# Altium schematic sheet scan_chain_level_shifters.SchDoc
size B; SheetNumber: 8; SheetTotal: 9
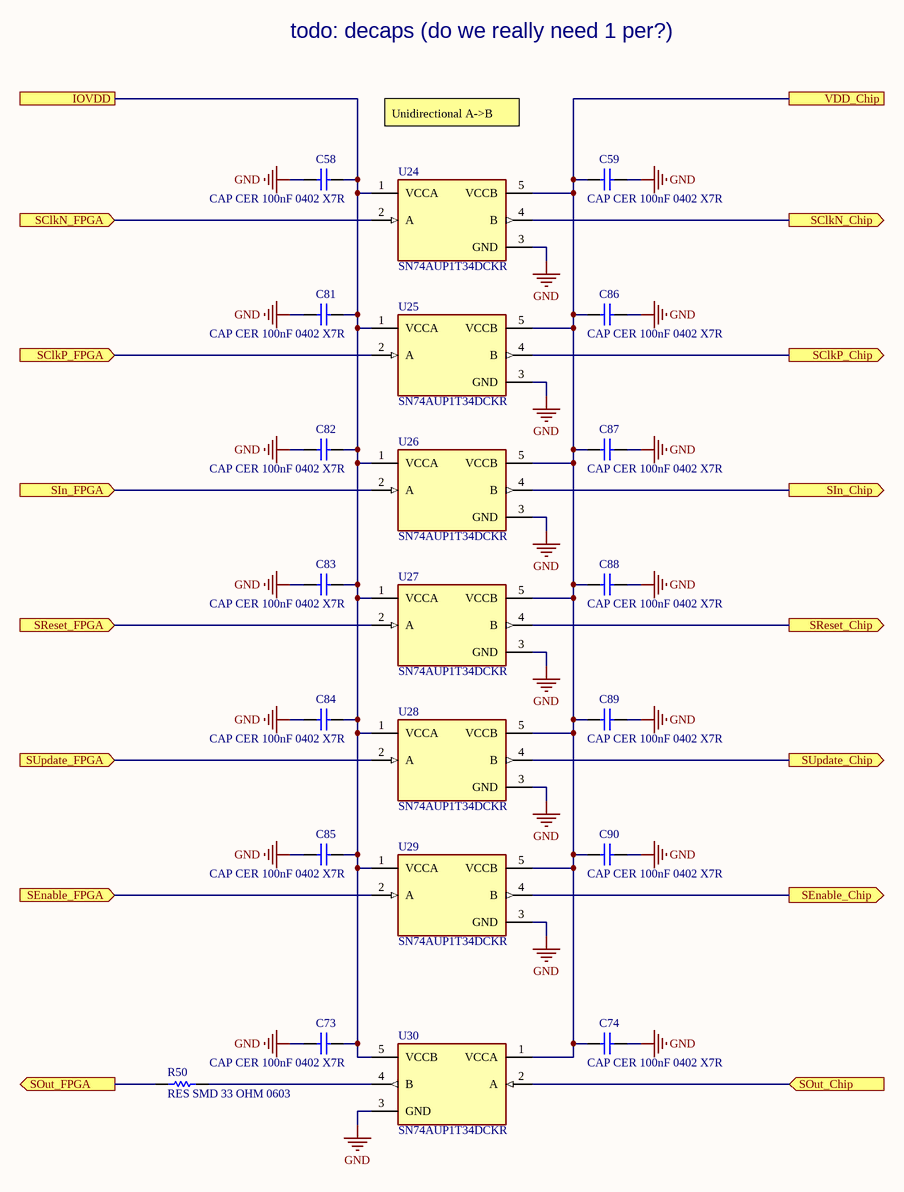
[diagram p0: scan_chain_level_shifters.SchDoc]

## Parts
C58  CAP CER 100nF 0402 X7R  [CAPC1050X55X23ML05T13]
C59  CAP CER 100nF 0402 X7R  [CAPC1050X55X23ML05T13]
C73  CAP CER 100nF 0402 X7R  [CAPC1050X55X23ML05T13]
C74  CAP CER 100nF 0402 X7R  [CAPC1050X55X23ML05T13]
C81  CAP CER 100nF 0402 X7R  [CAPC1050X55X23ML05T13]
C82  CAP CER 100nF 0402 X7R  [CAPC1050X55X23ML05T13]
C83  CAP CER 100nF 0402 X7R  [CAPC1050X55X23ML05T13]
C84  CAP CER 100nF 0402 X7R  [CAPC1050X55X23ML05T13]
C85  CAP CER 100nF 0402 X7R  [CAPC1050X55X23ML05T13]
C86  CAP CER 100nF 0402 X7R  [CAPC1050X55X23ML05T13]
C87  CAP CER 100nF 0402 X7R  [CAPC1050X55X23ML05T13]
C88  CAP CER 100nF 0402 X7R  [CAPC1050X55X23ML05T13]
C89  CAP CER 100nF 0402 X7R  [CAPC1050X55X23ML05T13]
C90  CAP CER 100nF 0402 X7R  [CAPC1050X55X23ML05T13]
R50  RES SMD 33 OHM 0603  [RESC1609X50X30LL10T20]
U24  SN74AUP1T34DCKR  [FP-DCK0005A-MFG]
U25  SN74AUP1T34DCKR  [FP-DCK0005A-MFG]
U26  SN74AUP1T34DCKR  [FP-DCK0005A-MFG]
U27  SN74AUP1T34DCKR  [FP-DCK0005A-MFG]
U28  SN74AUP1T34DCKR  [FP-DCK0005A-MFG]
U29  SN74AUP1T34DCKR  [FP-DCK0005A-MFG]
U30  SN74AUP1T34DCKR  [FP-DCK0005A-MFG]

## Ports
IOVDD, SClkN_Chip (out), SClkN_FPGA (in), SClkP_Chip (out), SClkP_FPGA (in), SEnable_Chip (out), SEnable_FPGA (in), SIn_Chip (out), SIn_FPGA (in), SOut_Chip (in), SOut_FPGA (out), SReset_Chip (out), SReset_FPGA (in), SUpdate_Chip (out), SUpdate_FPGA (in), VDD_Chip

## Nets
GND: C58.2 C59.1 C73.2 C74.1 C81.2 C82.2 C83.2 C84.2 C85.2 C86.1 C87.1 C88.1 C89.1 C90.1 U24.3(GND) U25.3(GND) U26.3(GND) U27.3(GND) U28.3(GND) U29.3(GND) U30.3(GND)
IOVDD: C58.1 C73.1 C81.1 C82.1 C83.1 C84.1 C85.1 U24.1(VCCA) U25.1(VCCA) U26.1(VCCA) U27.1(VCCA) U28.1(VCCA) U29.1(VCCA) U30.5(VCCB) ; port IOVDD
SClkN_Chip: U24.4(B) ; port SClkN_Chip
SClkN_FPGA: U24.2(A) ; port SClkN_FPGA
SClkP_Chip: U25.4(B) ; port SClkP_Chip
SClkP_FPGA: U25.2(A) ; port SClkP_FPGA
SEnable_Chip: U29.4(B) ; port SEnable_Chip
SEnable_FPGA: U29.2(A) ; port SEnable_FPGA
SIn_Chip: U26.4(B) ; port SIn_Chip
SIn_FPGA: U26.2(A) ; port SIn_FPGA
SOut_Chip: U30.2(A) ; port SOut_Chip
SOut_FPGA: R50.2 ; port SOut_FPGA
SReset_Chip: U27.4(B) ; port SReset_Chip
SReset_FPGA: U27.2(A) ; port SReset_FPGA
SUpdate_Chip: U28.4(B) ; port SUpdate_Chip
SUpdate_FPGA: U28.2(A) ; port SUpdate_FPGA
VDD_Chip: C59.2 C74.2 C86.2 C87.2 C88.2 C89.2 C90.2 U24.5(VCCB) U25.5(VCCB) U26.5(VCCB) U27.5(VCCB) U28.5(VCCB) U29.5(VCCB) U30.1(VCCA) ; port VDD_Chip
NetR50_1: R50.1 U30.4(B)

## Notes on the sheet
- todo: decaps (do we really need 1 per?)
- Unidirectional A->B

## Library data of the parts
C58 C59 C73 C74 C81-C90 = CMP-2000-05439-1: Chip Capacitor, 100 nF, +/- 10%, 16 V, -55 to 125 degC, 0402 (1005 Metric), RoHS, Tape and Reel; Manufacturer: Samsung Electro-Mechanics; Capacitance: 100000pF; Rated Voltage: 16V; Case Size/Dimension: 0402; Tolerance (%): ±10%; Manufacturer URL: http://www.samsungsem.com/global/index.jsp; Dielectric: X7R; Datasheet URL: https://datasheet.ciiva.com/29198/458718-da-01-en-vs-kondensator-0402-29198423.pdf; Datasheet Version: Nov-10
R50 = CMP-2000-03820-1: Part Number: CRCW0603100KFKEA; Manufacturer: Vishay Dale
U24-U30 = CMP-0859-00330-4: IC TRNSLTR UNIDIRECTIONAL SC70-5; Manufacturer: Texas Instruments; V B Max: 3.6V; Propagation Delay: 4.28ns; Description: Voltage Level Translator Unidirectional 1 Circuit 1 Channel  SC-70-5; Min Supply Voltage: 0.9V; Nominal Supply Current: 5.2uA; Frequency: 190MHz; Number Of Inputs: 1; Max Junction Temp: +150°C; Standoff Height: 0mm; Logic Function Desc: Non-Inverting; Ambient Temperature Range High: +85°C; Octopart: https://octopart.com/sn74aup1t34dckr-texas+instruments-22791115; Max Supply Voltage: 3.6V; Mouser Description: 1-Bit Unidirectional Voltage-Level Translator 5-SC70 -40 to 85; ComponentLink2URL: http://www.ti.com/lit/ds/symlink/sn74aup1t34.pdf; Category: IC; Device Class L1: Integrated Circuits (ICs); Manufacturer Part Number: SN74AUP1T34DCKR; Temperature: -40°C to +85°C; V A Min: 0.9V; Ambient Temperature Range Low: -40°C; V A Max: 3.6V; Package: DCK0005A; Device Class L3: Voltage Level Shifters; Number Of Outputs: 1; Digikey Description: IC TRNSLTR UNIDIRECTIONAL SC70-5; Device Class L2: Logic ICs; Temperature Range Low: -40°C; Number Of Circuits: 1; Lead Free: Yes; ComponentLink2Description: Datasheet; RoHS: TRUE; Height: 1.1mm; Automotive: No; Temperature Range High: +85°C; V B Min: 0.9V